# EAGLE design AJH_as3320_HPF_03_4hp (EAGLE 9.5.2)
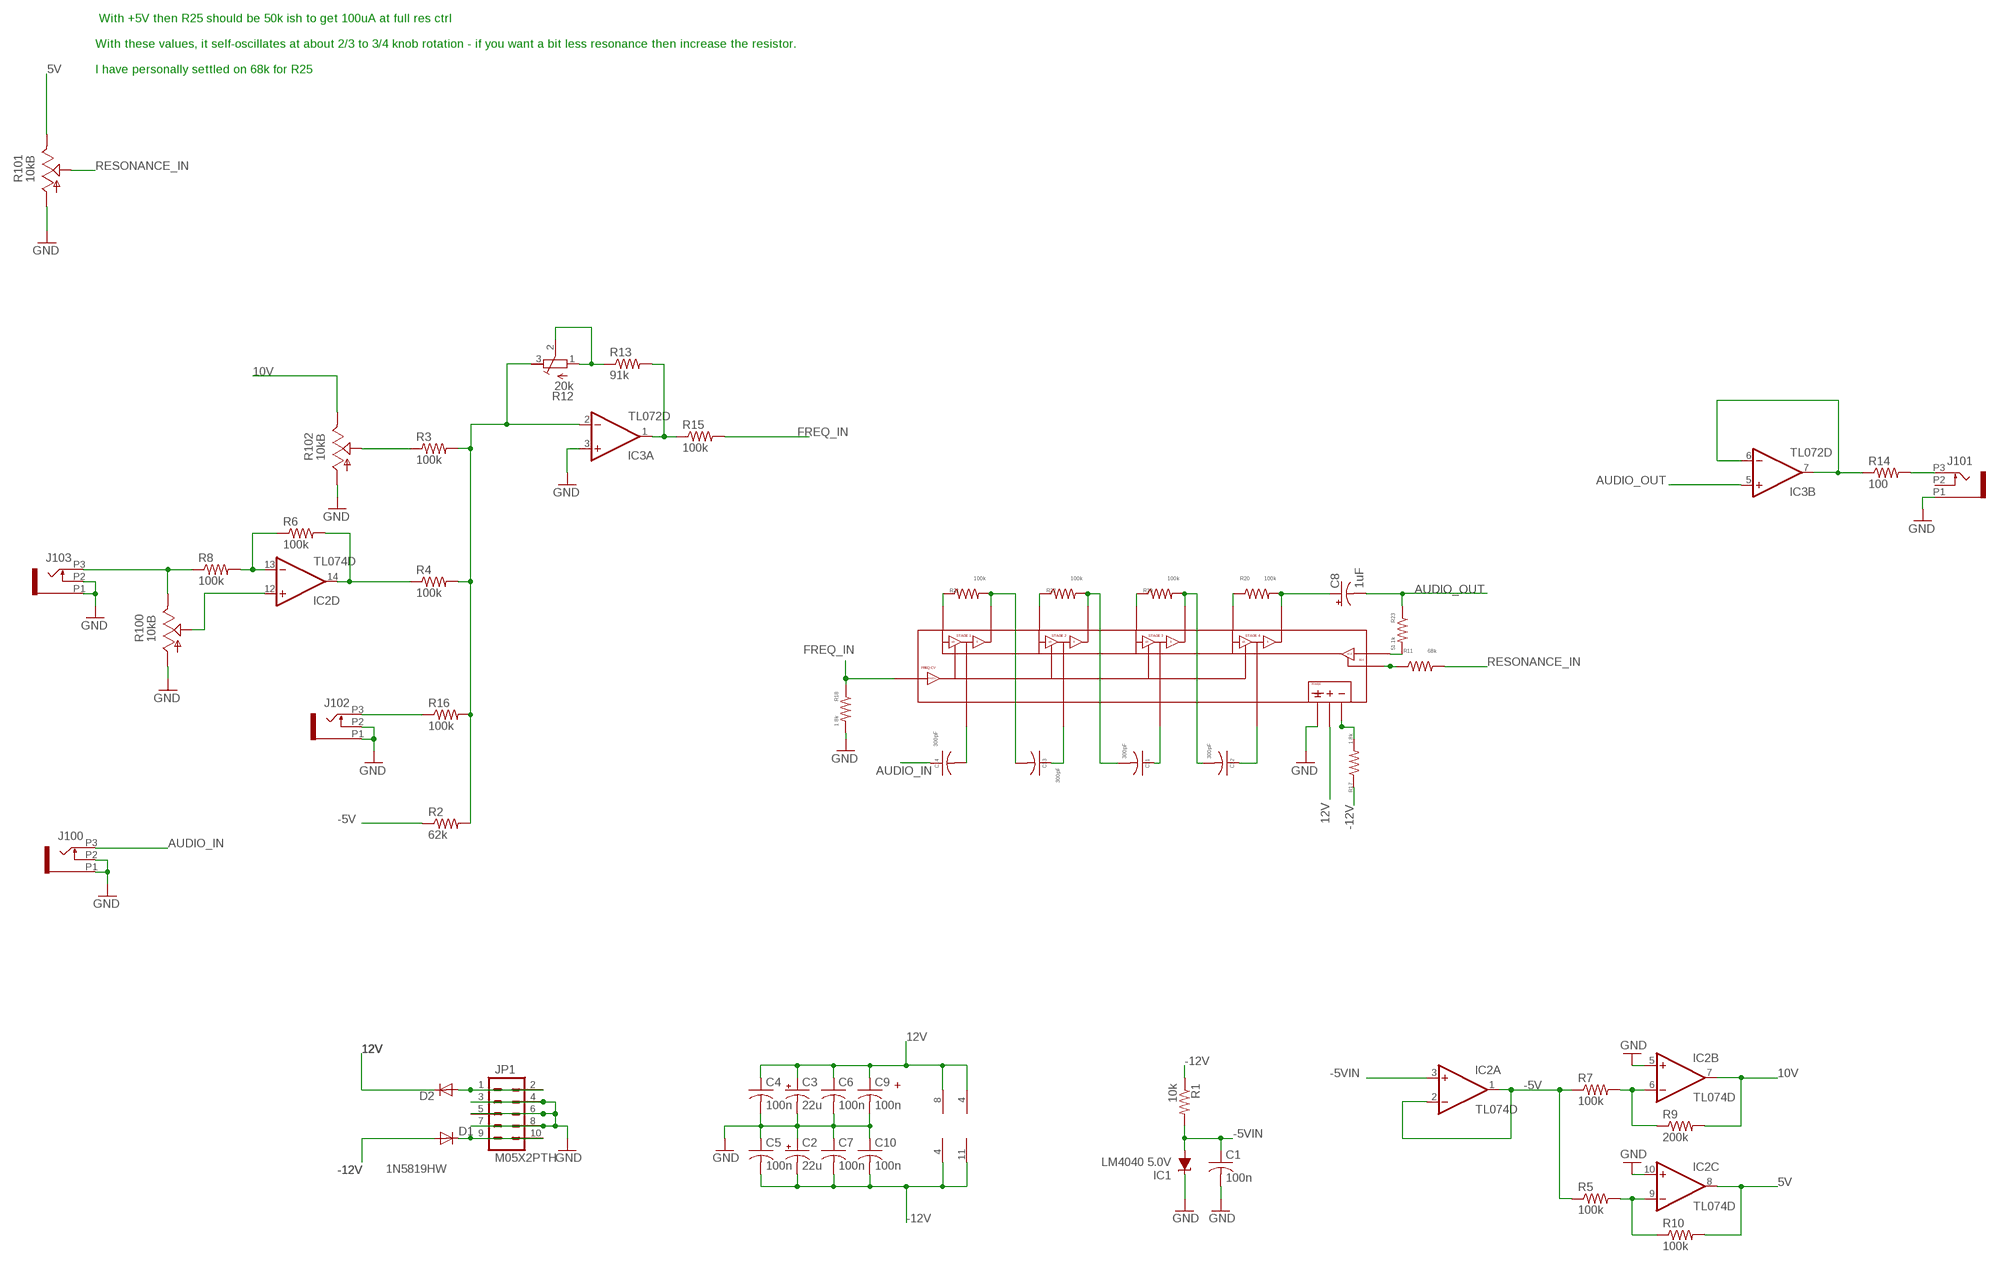
[diagram p0: schematic, sheet 1]

## Parts
C1  100n  C-USC0603  [C0603]
C2  22u  CPOL-USB  [PANASONIC_B]
C3  22u  CPOL-USB  [PANASONIC_B]
C4  100n  C-USC0603  [C0603]
C5  100n  C-USC0603  [C0603]
C6  100n  C-USC0603  [C0603]
C7  100n  C-USC0603  [C0603]
C8  1uF  CPOL-USB  [PANASONIC_B]
C9  100n  C-USC0603  [C0603]
C10  100n  C-USC0603  [C0603]
C11  300pF  C-USC0603  [C0603]
C12  300pF  C-USC0603  [C0603]
C13  300pF  C-USC0603  [C0603]
C14  300pF  C-USC0603  [C0603]
D1  1N5819HW  DIODE-SOD123  [SOD123]
D2  1N5819HW  DIODE-SOD123  [SOD123]
IC1  LM4040 5.0V  LM4041C12DBZ  [DBZ_R-PDSO-G3]
IC2  TL074D  [SO14]
IC3  TL072D  [SO08]
IC4  CEM3320_UNFOLDEDQFN  [QFN24]
J100  PJ301_THONKICONN6  [WQP_PJ_301M6]
J101  PJ301_THONKICONN6  [WQP_PJ_301M6]
J102  PJ301_THONKICONN6  [WQP_PJ_301M6]
J103  PJ301_THONKICONN6  [WQP_PJ_301M6]
JP1  M05X2PTH  [AVR_ICSP]
R1  10k  R-US_R0603  [R0603]
R2  62k  R-US_R0603  [R0603]
R3  100k  R-US_R0603  [R0603]
R4  100k  R-US_R0603  [R0603]
R5  100k  R-US_R0603  [R0603]
R6  100k  R-US_R0603  [R0603]
R7  100k  R-US_R0603  [R0603]
R8  100k  R-US_R0603  [R0603]
R9  200k  R-US_R0603  [R0603]
R10  100k  R-US_R0603  [R0603]
R11  68k  R-US_R0603  [R0603]
R12  20k  R-TRIMM3296X  [RTRIM3296X]
R13  91k  R-US_R0603  [R0603]
R14  100  R-US_R0603  [R0603]
R15  100k  R-US_R0603  [R0603]
R16  100k  R-US_R0603  [R0603]
R17  1.8k  R-US_R0603  [R0603]
R18  1.8k  R-US_R0603  [R0603]
R19  100k  R-US_R0603  [R0603]
R20  100k  R-US_R0603  [R0603]
R21  100k  R-US_R0603  [R0603]
R22  100k  R-US_R0603  [R0603]
R23  51.1k  R-US_R0603  [R0603]
R100  10kB  POT_USVERTICAL  [ALPS_POT_VERTICAL]
R101  10kB  POT_USVERTICAL  [ALPS_POT_VERTICAL]
R102  10kB  POT_USVERTICAL  [ALPS_POT_VERTICAL]

## Nets
5V [power]: IC2.8(C:OUT) R10.2 R101.P$1(E)
10V [power]: IC2.7(B:OUT) R9.2 R102.P$1(E)
12V [power]: C3.+ C4.1 C6.1 C9.1 D2.C IC2.4(P:V+) IC3.8(P:V+) IC4.P$22(POSRAIL)
-5V [power]: IC2.1(A:OUT) IC2.2(A:-IN) R2.1 R5.1 R7.1
-5VIN [power]: C1.1 IC1.2(A) IC2.3(A:+IN) R1.2
-12V [power]: C2.- C5.2 C7.2 C10.2 D1.A IC2.11(P:V-) IC3.4(P:V-) R1.1 R17.1
AUDIO_IN: C14.1 J100.P3
AUDIO_OUT: C8.- IC3.5(B:+IN) R23.1
FREQ_IN: IC4.P$19(FREQCV) R15.2 R18.1
GND [power]: C1.2 C2.+ C3.- C4.2 C5.1 C6.2 C7.1 C9.2 C10.1 IC1.1(C) IC2.5(B:+IN) IC2.10(C:+IN) IC3.3(A:+IN) IC4.P$7(GROUND) J100.P1 J100.P2 J101.P1 J102.P1 J102.P2 J103.P1 J103.P2 JP1.3 JP1.4 JP1.5 JP1.6 JP1.7 JP1.8 R18.2 R100.P$3(A) R101.P$3(A) R102.P$3(A)
N$1: IC3.6(B:-IN) IC3.7(B:OUT) R14.1
N$3: IC2.12(D:+IN) R100.P$2(S)
N$4: R3.1 R102.P$2(S)
N$5: IC2.13(D:-IN) R6.1 R8.2
N$6: D2.A JP1.1 JP1.2
N$7: IC3.2(A:-IN) R2.2 R3.2 R4.2 R12.3(A) R16.2
N$8: IC3.1(A:OUT) R13.2 R15.1
N$10: J102.P3 R16.1
N$11: J101.P3 R14.2
N$12: IC2.14(D:OUT) R4.1 R6.2
N$13: IC2.9(C:-IN) R5.2 R10.1
N$14: IC4.P$14(FEEDBACK_IN) R23.2
N$15: IC2.6(B:-IN) R7.2 R9.1
N$20: D1.C JP1.9 JP1.10
N$55: R12.1(E) R12.2(S) R13.1
N$82: J103.P3 R8.1 R100.P$1(E)
N$121 [nearfilter]: IC4.P$20(NEGRAIL) R17.2
N$124 [nearfilter]: IC4.P$15(RESONANCE_CV) R11.1
N$128 [nearfilter]: C14.2 IC4.P$9(STAGE1_CAP)
N$129 [nearfilter]: IC4.P$4(STAGE1_IN) R21.1
N$130 [nearfilter]: C13.2 IC4.P$12(STAGE1_OUT) R21.2
N$131 [nearfilter]: C13.1 IC4.P$8(STAGE2_CAP)
N$132 [nearfilter]: IC4.P$5(STAGE2_IN) R22.1
N$133 [nearfilter]: C11.2 IC4.P$11(STAGE2_OUT) R22.2
N$134 [nearfilter]: C11.1 IC4.P$24(STAGE3_CAP)
N$135 [nearfilter]: IC4.P$2(STAGE3_IN) R19.1
N$136 [nearfilter]: C12.2 IC4.P$23(STAGE3_OUT) R19.2
N$137: C12.1 IC4.P$17(STAGE4_CAP)
N$138 [nearfilter]: IC4.P$3(STAGE4_IN) R20.1
N$139 [nearfilter]: C8.+ IC4.P$16(STAGE4_OUT) R20.2
RESONANCE_IN: R11.2 R101.P$2(S)
Unconnected: J101.P2

## Notes on the sheet
- With +5V then R25 should be 50k ish to get 100uA at full res ctrl
  
  With these values, it self-oscillates at about 2/3 to 3/4 knob rotation - if you want a bit less resonance then increase the resistor.
  
  I have personally settled on 68k for R25
- +

## Library data of the parts
C1 C4-C7 C9 C10 = rcl:C-US: CAPACITOR, American symbol
C2 C3 = rcl:CPOL-US: POLARIZED CAPACITOR, American symbol
C8 = rcl:CPOL-US: POLARIZED CAPACITOR, American symbol; SPICEPREFIX: C
C11-C14 = rcl:C-US: CAPACITOR, American symbol; SPICEPREFIX: C
D1 D2 = diode:DIODE-: DIODE
IC1 = texas:LM4041: PRECISION MICROPOWER SHUNT VOLTAGE REFERENCE Source: http://focus.ti.com/lit/ds/slcs146e/slcs146e.pdf
IC2 = linear:TL074: OP AMP
IC3 = linear:TL072: OP AMP
IC4 = CEM:CEM3320_UNFOLDED
J100-J103 = og-pj301_variations:PJ301_THONKICONN
JP1 = og-header:M05X2: Header 5x2 Standard 10-pin dual row 0.1" header. Commonly used with AVR-ISP. Use with Spark Fun Electronics SKU: PRT-00778
R1-R10 R13-R16 R19-R22 = resistor:R-US_: RESISTOR, American symbol
R11 R17 R18 R23 = rcl:R-US_: RESISTOR, American symbol; SPICEPREFIX: R
R12 = rcl:R-TRIMM: Trimm resistor
R100-R102 = og-pots:POT_US

## Net classes
0 default: width 0.152 mm
1 power: width 0.406 mm
2 nearfilter: width 0.152 mm

## Board
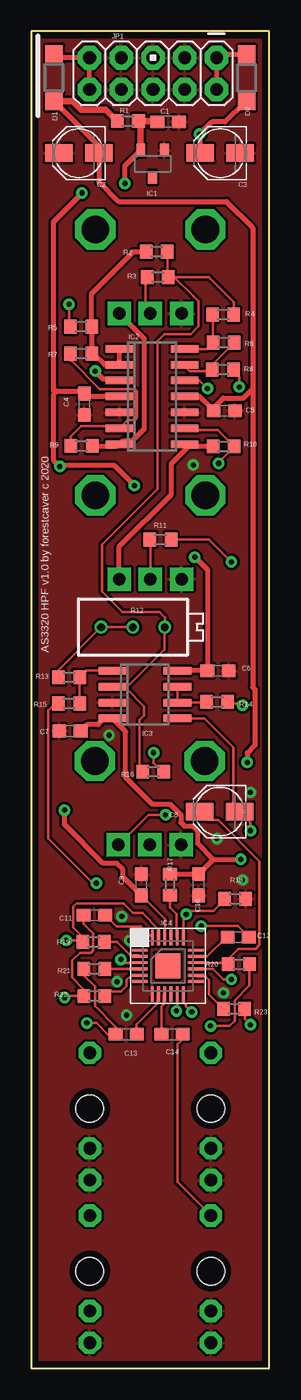
[diagram p1: board, top side]
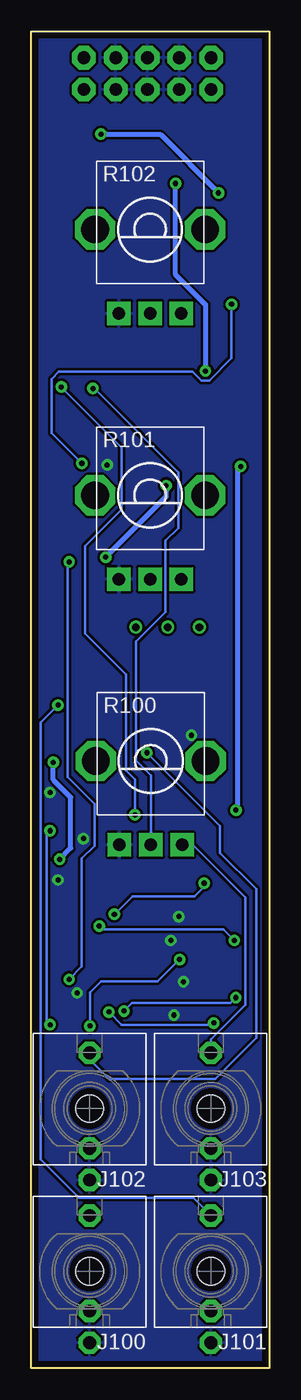
[diagram p2: board, bottom side, seen from below]

Size 19.03 x 106.76 mm. Coordinates in mm from the lower left corner, seen from the top.
Outline: 0,0 19.03,0 19.03,106.76 0,106.76 0,0
Copper layers (1*16): Top 0.035mm / dielectric 1.5mm / Bottom 0.035mm
Design rules "Mutable_PCBCart-Standard": minimum track width 8mil, minimum drill 0.4mm, track to track 8mil, track to pad 8mil, pad to pad 8mil, via to via 8mil, smd to smd 8mil, copper to edge 20mil, drill to drill 8mil, minimum pad ring 8mil, minimum via ring 10mil, stop-mask expansion 3mil, vias tented up to drill 25mil, thermal gap 8mil

### Footprints (pad centres in the part's own frame; a part is rotated, then mirrored left to right if it is on the bottom)
C0603 = smd 1.1 x 1: 1 -0.85,0; 2 0.85,0
PANASONIC_B = smd 2.2 x 1.4: + 1.6,0; - -1.6,0
SOD123 = smd 1.4 x 1.4: A 1.9,0; C -1.9,0
DBZ_R-PDSO-G3 = smd 0.7 x 1: 1 -0.95,-1.1; 2 0.95,-1.1; 3 0,1.1
SO14 = smd 0.6 x 2.2: 1 -3.81,-2.6; 2 -2.54,-2.6; 3 -1.27,-2.6; 4 0,-2.6; 5 1.27,-2.6; 6 2.54,-2.6; 7 3.81,-2.6; 8 3.81,2.6; 9 2.54,2.6; 10 1.27,2.6; 11 0,2.6; 12 -1.27,2.6; 13 -2.54,2.6; 14 -3.81,2.6
SO08 = smd 0.6 x 2.2: 1 -1.905,-2.6; 2 -0.635,-2.6; 3 0.635,-2.6; 4 1.905,-2.6; 5 1.905,2.6; 6 0.635,2.6; 7 -0.635,2.6; 8 -1.905,2.6
QFN24 = smd 1.25 x 0.23: P$1 -2.25,1.25; P$2 -2.25,0.75; P$3 -2.25,0.25; P$4 -2.25,-0.25; P$5 -2.25,-0.75; P$6 -2.25,-1.25; P$13 2.25,-1.25; P$14 2.25,-0.75; P$15 2.25,-0.25; P$16 2.25,0.25; P$17 2.25,0.75; P$18 2.25,1.25 | smd 0.23 x 1.25: P$7 -1.25,-2.25; P$8 -0.75,-2.25; P$9 -0.25,-2.25; P$10 0.25,-2.25; P$11 0.75,-2.25; P$12 1.25,-2.25; P$19 1.25,2.25; P$20 0.75,2.25; P$21 0.25,2.25; P$22 -0.25,2.25; P$23 -0.75,2.25; P$24 -1.25,2.25 | smd 2 x 2: PAD 0,0
WQP_PJ_301M6 = drill 1.016 pad 1.778 octagon: P1 0,-5.715; P2 0,-3.175; P3 0,4.445 | hole 2.2: 0,0
AVR_ICSP = drill 1.016 pad 1.88 octagon: 1 -1.27,5.08; 2 1.27,5.08; 3 -1.27,2.54; 4 1.27,2.54; 5 -1.27,0; 6 1.27,0; 7 -1.27,-2.54; 8 1.27,-2.54; 9 -1.27,-5.08; 10 1.27,-5.08
R0603 = smd 1 x 1.1: 1 -0.85,0; 2 0.85,0
RTRIM3296X = drill 0.61: 1 0,-2.54; 2 0,0; 3 0,2.54
ALPS_POT_VERTICAL = drill 1 pad 1.88 square: P$1 -2.5,6.7; P$2 0,6.7; P$3 2.5,6.7 | drill 2.2 pad 3.175 octagon: P$4 -4.4,0; P$5 4.4,0

### Placement (x,y rotation side)
C1  10.95,99.53 0 top
C2  3.81,97.03 180 top
C3  15.11,97.03 180 top
C4  4.24,76.98 270 top
C5  15.44,76.46 180 top
C6  14.94,55.69 0 top
C7  3.1,50.88 0 top
C8  15.06,44.45 180 top
C9  8.8,38.59 90 top
C10  13.38,38.59 90 top
C11  5.04,36.2 180 top
C12  16.55,34.42 0 top
C13  7.58,26.67 180 top
C14  11.26,26.67 180 top
D1  1.83,103.06 270 top
D2  17.23,103.04 90 top
IC1  9.7,96.17 180 top
IC2  9.65,77.6 270 top
IC3  9.09,53.79 270 top
IC4  10.92,32.13 0 top
J100  14.37,7.75 0 bottom
J101  4.67,7.75 0 bottom
J102  14.37,20.74 0 bottom
J103  4.67,20.74 0 bottom
JP1  9.74,103.38 270 top
R1  7.73,99.59 0 top
R2  10.03,89.15 0 top
R3  10.11,87.13 0 top
R4  15.35,84.13 0 top
R5  3.98,83.17 180 top
R6  15.38,81.9 180 top
R7  3.98,81.03 180 top
R8  15.32,79.75 180 top
R9  4.02,73.65 0 top
R10  15.39,73.61 180 top
R11  10.33,66.17 180 top
R12  8.13,59.18 270 top
R13  3.02,55.17 0 top
R14  14.86,53.21 0 top
R15  3.02,53.09 180 top
R16  9.75,47.63 180 top
R17  11.09,38.61 270 top
R18  16.3,37.47 0 top
R19  4.99,34.04 180 top
R20  16.6,32.26 180 top
R21  5.04,31.88 180 top
R22  5.04,29.72 180 top
R23  16.22,28.7 180 top
R100  9.47,48.49 180 bottom
R101  9.53,69.71 180 bottom
R102  9.53,90.93 180 bottom

### Tracks (layer width: path | path; a pad name or v marks a point on that pad's centre or on a via)
5V
  Top 0.406: R10.2 12.57,73.61 | 12.57,73.61 12.43,73.61 IC2.8 | R101.P$1 7.03,65.6 11.2,69.77 11.2,72.24 12.57,73.61
10V
  Top 0.406: R9.2 6.92,73.65 IC2.7 7.29,74.02 8.04,74.02 9.02,74.99 9.02,82.23 R102.P$1
12V  (via drill 0.41)
  Top 0.203: IC4.P$22 10.67,35.75 10.67,35.88 C9.1
  Top 0.406: D2.C 17.1,101.14 15.49,99.54 14.45,99.54 v13.46,98.55 13.51,98.5 C3.+ | v4.06,93.85 1.77,91.56 1.77,78.04 2.02,78.04 | v8.26,70.48 6.63,72.11 2.29,72.11 v2.29,72.01 1.8,72.49 1.8,77.82 2.02,78.04 | v13.08,64.77 14.09,63.76 C6.1 IC3.8 | C9.1 7.33,39.22 7.33,39.81 6.82,40.32 5.76,40.32 2.67,43.41 v2.67,44.58 | IC2.4 4.48,77.6 C4.1 4.03,78.04 2.02,78.04
  Bottom 0.406: v4.06,93.85 4.06,93.88 8.71,98.52 13.43,98.52 v13.46,98.55 | v8.26,70.48 8.26,69.6 v13.08,64.77 | v2.29,72.01 2.54,72.01 2.54,44.7 v2.67,44.58
-5V
  Top 0.406: IC2.1 IC2.2 5.85,80.14 4.96,81.03 R7.1 R5.1 4.83,85.82 8.17,89.15 R2.1
-5VIN  (via drill 0.41)
  Top 0.406: IC2.3 6.92,78.99 5.74,78.99 v5.11,79.63 | v7.49,94.61 7.49,96.02 IC1.2
  Top 0.508: C1.1 10.04,99.59 R1.2 8.75,99.42 IC1.2
  Bottom 0.406: v5.11,79.63 5.11,79.76 5.09,79.77 5.09,84.94 7.49,87.34 v7.49,94.61
-12V  (via drill 0.4, 0.41)
  Top 0.406: IC2.11 13.45,77.6 C5.2 14.59,76.71 15.35,77.47 16.98,77.47 17.72,78.22 | v17.27,48.39 17.27,49.15 17.88,49.76 17.88,54.21 17.72,54.37 17.72,78.22 | C7.2 4.45,51.39 5.36,51.39 5.86,51.89 IC3.4 7.54,50.84 7.54,47.19 9.67,45.06 11.1,45.06 11.96,44.2 11.96,43.58 12.27,43.27 12.95,43.27 13.32,42.9 13.32,41.89 14.57,40.64 | D1.A 5.41,97.58 C2.- 5.41,94.74 6.99,93.16 15.62,93.16 17.72,91.06 17.72,78.22 | R17.1 13.36,39.46 C10.2 14.57,40.64 | 14.57,40.64 v16.76,40.64
  Top 0.508: D1.A 3.32,101.16 3.97,100.51 5.96,100.51 R1.1
  Bottom 0.406: v17.27,48.39 17.27,46.99 15.88,45.59 15.88,41.53 v16.76,40.64
AUDIO_IN
  Top 0.203: C14.1 12.11,26.29 11.68,25.86 11.68,14.88 J100.P3
AUDIO_OUT  (via drill 0.41)
  Top 0.203: v17.53,27.43 17.07,27.89 R23.1 | v17.53,42.93 17.53,43.59 C8.- 16.17,44.94 16.17,49.58 13.86,51.89 IC3.5
  Bottom 0.203: v17.53,27.43 17.78,27.69 17.78,42.67 v17.53,42.93
FREQ_IN  (via drill 0.41)
  Top 0.203: R15.2 1.92,53.09 1.34,52.51 1.34,42.29 4.9,38.73 v5.21,38.73 | R18.1 15.45,37.4 14.55,36.51 12.64,36.51 v12.39,36.25 12.17,36.03 IC4.P$19
  Bottom 0.203: v12.39,36.25 12.36,36.25 10.92,37.69 5.97,37.69 5.33,38.33 5.33,38.61 v5.21,38.73
GND  (via drill 0.4)
  other vias: 16.89,38.99 17.53,45.97 6.22,50.55 7.24,36.07 7.87,34.16 6.86,30.86 7.62,28.19 15.37,29.97 14.86,42.29 12.95,72.14
  pour Top: -0.89,107.7 19.43,107.7 20.07,107.06 20.32,106.81 20.32,-0.25 19.3,-1.27 -0.25,-1.27 -0.89,-0.64
  pour Bottom: -1.4,108.33 20.07,108.33 20.07,-0.64 -1.14,-0.64 -1.4,-0.38
N$1
  Top 0.203: 12.69,53.03 11.82,53.03 IC3.6 | 11.82,54.3 IC3.7 IC3.6 | IC3.6 13.95,53.16 R14.1
N$3  (via drill 0.41)
  Top 0.203: 12.25,78.74 IC2.12 13.46,78.87 v14.1,78.23
  Bottom 0.203: v14.1,78.23 13.97,78.23 7.27,71.53 7.27,67.1 8.28,66.08 8.28,60.4 10.65,58.03 10.65,48.53 9.47,47.35 R100.P$2
N$4
  Top 0.203: R3.1 9.14,87.02 9.14,84.61 R102.P$2
N$5
  Top 0.203: R6.1 14.47,80.15 R8.2 14.35,79.62 12.64,79.62 12.25,80.01 IC2.13
N$6
  Top 0.406: JP1.2 JP1.1 15.11,104.94 D2.A
N$7
  Top 0.203: 11.43,87.13 R3.2 10.88,87.2 R2.2 | 11.43,87.13 12.96,85.6 13.36,85.21 13.36,83.2 12.76,82.6 10.67,82.6 10.11,82.04 10.11,70.22 5.66,65.77 5.66,62.01 7.29,60.38 10.24,60.38 10.67,59.94 R12.3 10.67,57.4 7.69,54.43 IC3.2 6.6,54.43 6.73,54.3 7.56,54.3 9.02,52.84 9.02,52.13 8.65,51.77 8.65,47.89 R16.2 | R4.2 16.2,85.14 14.21,87.13 11.43,87.13
N$8
  Top 0.203: R15.1 R13.2 4.39,55.7 6.39,55.7 | 6.39,55.7 6.38,55.68 | 6.39,55.7 IC3.1
N$10  (via drill 0.41)
  Top 0.203: v9.78,49.15 9.78,48.33 10.48,47.63 R16.1
  Bottom 0.203: v9.78,49.15 3.94,43.31 3.94,41.15 1.04,38.26 1.04,26.39 4.32,23.11 12.81,23.11 14.37,24.67 J102.P3
N$11  (via drill 0.41)
  Top 0.203: v16.89,52.96 16.76,53.09 15.84,53.09 R14.2
  Bottom 0.203: v16.89,52.96 18.29,51.56 18.29,16.66 15.21,13.59 6.07,13.59 J101.P3
N$12
  Top 0.203: R4.1 14.53,84.1 R6.2 14.02,81.39 12.49,81.39 12.38,81.28 IC2.14
N$13  (via drill 0.41)
  Top 0.203: IC2.9 12.38,74.93 14.92,74.93 R10.1 14.99,72.36 v14.99,72.26 | v3.01,84.96 3.01,83.29 R5.2
  Bottom 0.203: v14.99,72.26 17.4,74.68 17.4,79 16.83,79.57 6.12,79.57 5.42,78.87 4.79,78.87 3.01,80.64 v3.01,84.96
N$14
  Top 0.203: R23.2 14.22,29.84 14.22,31 13.92,31.3 13.25,31.3 IC4.P$14
N$15
  Top 0.203: 3.58,73.65 R9.1 3.17,74.41 4,75.25 6.86,75.25 IC2.6 7.72,75.72 8.28,75.72 8.46,75.9 8.46,78.02 8.28,78.2 5.46,78.2 3.13,80.52 R7.2 3.13,80.47
N$20
  Top 0.406: D1.C 2.14,104.65 JP1.9 JP1.10
N$55
  Top 0.203: R13.1 2.17,55.77 R12.1 R12.2
N$82  (via drill 0.4, 0.41)
  Top 0.203: R8.1 16.18,79.62 16.64,79.16 v16.64,78.36 | R100.P$1 9.38,44.2 v10.74,44.2
  Bottom 0.203: v10.74,44.2 10.74,47.03 11.45,47.74 11.45,55.38 14.73,58.66 14.73,65.66 11.81,68.58 11.81,73.53 v16.64,78.36 | R100.P$1 6.08,41.79 1.91,37.61 1.91,29.02 4.67,26.26 J103.P3
N$121
  Top 0.203: R17.2 11.09,36.78 11.59,36.27 11.59,34.46 IC4.P$20
N$124  (via drill 0.4)
  Top 0.203: IC4.P$15 14.54,31.88 15.37,31.05 v16,31.05 | R11.1 14.22,66.17 v16,64.39
  Bottom 0.203: v16,31.05 14.99,32.07 14.99,40.71 13.97,41.72 13.97,45.05 16.13,47.2 16.13,64.26 v16,64.39
N$128
  Top 0.203: C14.2 10.41,28.88 10.59,29.05 10.59,29.8 IC4.P$9
N$129
  Top 0.203: R21.1 IC4.P$4
N$130  (via drill 0.4)
  Top 0.203: R21.2 4.19,31.37 5.09,30.47 5.09,28.91 6.73,27.27 C13.2 6.1,26.67 5.21,27.56 v4.45,27.56 | IC4.P$12 12.17,29.16 12.37,28.96 12.37,28.91 v12.83,28.45
  Bottom 0.203: v12.83,28.45 11.81,27.43 4.57,27.43 v4.45,27.56
N$131
  Top 0.203: IC4.P$8 10.09,29.8 10.09,29.13 8.43,27.47 C13.1
N$132
  Top 0.203: R22.1 6.28,30.1 7.17,30.1 7.62,30.55 7.62,31 8,31.38 IC4.P$5
N$133  (via drill 0.4)
  Top 0.203: C11.2 4.19,35.47 4.95,34.71 4.95,33.36 4.77,33.18 3.89,33.18 3.26,32.55 3.26,31.2 4.19,30.27 R22.2 2.79,29.72 v2.67,29.59 | IC4.P$11 11.67,28.59 v11.61,28.52
  Bottom 0.203: v11.61,28.52 10.97,29.16 3.1,29.16 v2.67,29.59
N$134
  Top 0.203: IC4.P$24 8.78,35.27 6.82,35.27 C11.1
N$135
  Top 0.203: IC4.P$2 8.59,32.96 7.92,32.96 6.85,34.04 R19.1
N$136  (via drill 0.4)
  Top 0.203: C12.2 16.51,35.31 v13.59,35.31 | v2.79,34.16 4.01,34.16 R19.2 4.14,34.38 3.34,35.19 3.34,36.82 3.64,37.13 7.37,37.13 8.15,36.35 8.88,36.35 10.17,35.05 IC4.P$23
  Bottom 0.203: v13.59,35.31 13.34,35.05 3.68,35.05 v2.79,34.16
N$137
  Top 0.203: C12.1 15.6,34.42 14.06,32.88 IC4.P$17
N$138  (via drill 0.4)
  Top 0.203: v7.17,32.64 7.43,32.38 IC4.P$3 | R20.1 17.45,30.56 16.26,29.38 16.26,27.73 15.86,27.32 v14.33,27.32
  Bottom 0.203: v14.33,27.32 14.33,29.99 13.44,30.88 8.93,30.88 v7.17,32.64
N$139
  Top 0.203: C8.+ 14.14,43.77 14.96,43.77 18.25,40.48 18.25,33.79 17.96,33.49 16.57,33.49 15.75,32.67 R20.2 15.62,32.38 IC4.P$16
RESONANCE_IN
  Top 0.203: R11.2 9.53,66.12 R101.P$2

### Text on the board
tPlace: AS3320 HPF v1.0 by forestcaver c 2020